# Altium schematic sheet sensor_array_interface.SchDoc
size A portrait; SheetNumber: 3; SheetTotal: 3
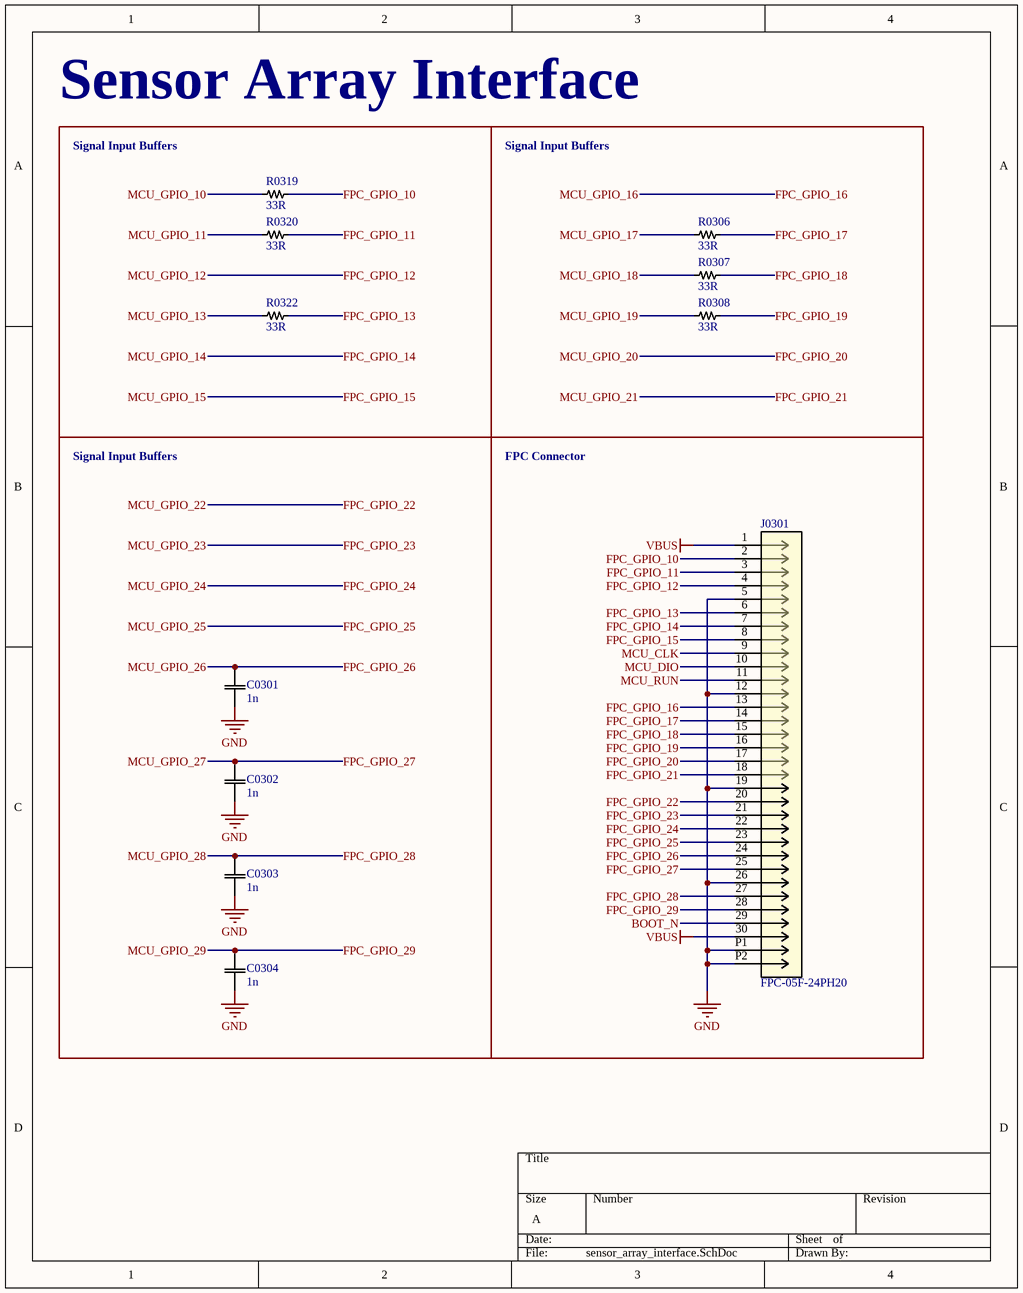
[diagram p0: sensor_array_interface.SchDoc]

## Parts
C0301  1n  [CAPC10555_55N_KEM]
C0302  1n  [CAPC10555_55N_KEM]
C0303  1n  [CAPC10555_55N_KEM]
C0304  1n  [CAPC10555_55N_KEM]
J0301  FPC-05F-24PH20  [FPC-05F-30PH20]
R0306  33R  [RES0402_CPF_TYCO_TYC]
R0307  33R  [RES0402_CPF_TYCO_TYC]
R0308  33R  [RES0402_CPF_TYCO_TYC]
R0319  33R  [RES0402_CPF_TYCO_TYC]
R0320  33R  [RES0402_CPF_TYCO_TYC]
R0322  33R  [RES0402_CPF_TYCO_TYC]

## Blocks framed on the sheet
Sensor Array Interface: R0319 R0320 R0322
Signal Input Buffers: R0306 R0307 R0308
Signal Input Buffers: C0301 C0302 C0303 C0304
FPC Connector: J0301

## Nets
GND: C0301.1 C0302.1 C0303.1 C0304.1 J0301.5 J0301.12 J0301.19 J0301.26 J0301.P1 J0301.P2
VBUS: J0301.1 J0301.30
BOOT_N: J0301.29
FPC_GPIO_10: J0301.2 R0319.1
FPC_GPIO_11: J0301.3 R0320.1
FPC_GPIO_12: J0301.4  [also labelled MCU_GPIO_12]
FPC_GPIO_13: J0301.6 R0322.1
FPC_GPIO_14: J0301.7  [also labelled MCU_GPIO_14]
FPC_GPIO_15: J0301.8  [also labelled MCU_GPIO_15]
FPC_GPIO_16: J0301.13  [also labelled MCU_GPIO_16]
FPC_GPIO_17: J0301.14 R0306.1
FPC_GPIO_18: J0301.15 R0307.1
FPC_GPIO_19: J0301.16 R0308.1
FPC_GPIO_20: J0301.17  [also labelled MCU_GPIO_20]
FPC_GPIO_21: J0301.18  [also labelled MCU_GPIO_21]
FPC_GPIO_22: J0301.20  [also labelled MCU_GPIO_22]
FPC_GPIO_23: J0301.21  [also labelled MCU_GPIO_23]
FPC_GPIO_24: J0301.22  [also labelled MCU_GPIO_24]
FPC_GPIO_25: J0301.23  [also labelled MCU_GPIO_25]
FPC_GPIO_26: C0301.2 J0301.24  [also labelled MCU_GPIO_26]
FPC_GPIO_27: C0302.2 J0301.25  [also labelled MCU_GPIO_27]
FPC_GPIO_28: C0303.2 J0301.27  [also labelled MCU_GPIO_28]
FPC_GPIO_29: C0304.2 J0301.28  [also labelled MCU_GPIO_29]
MCU_CLK: J0301.9
MCU_DIO: J0301.10
MCU_GPIO_10: R0319.2
MCU_GPIO_11: R0320.2
MCU_GPIO_13: R0322.2
MCU_GPIO_17: R0306.2
MCU_GPIO_18: R0307.2
MCU_GPIO_19: R0308.2
MCU_RUN: J0301.11

## Notes on the sheet
- Signal Input Buffers

## Library data of the parts
C0301 C0302 C0303 C0304 = C0402: SMD Comm X7R, Ceramic, SMD, MLCC, Temperature Stable, 0402; Manufacturer_Name: Kemet; Manufacturer_Part_Number: C0402C104K4RACTU; Copyright: Copyright (C) 2025 Ultra Librarian. All rights reserved.; Datasheet: https://content.kemet.com/datasheets/KEM_C1002_X7R_SMD.pdf
J0301 = FPC-05F-24PH20_1: 24 Pin 0.5 Pitch FPC connector
R0306 R0307 R0308 R0319 R0320 R0322 = R0402: CPF 0402 RL; Manufacturer_Name: TE Connectivity; Manufacturer_Part_Number: CPF0402B33RE1; Copyright: Copyright (C) 2025 Ultra Librarian. All rights reserved.; Datasheet: https://www.te.com/commerce/DocumentDelivery/DDEController?Action=srchrtrv&DocNm=1773200&DocType=Data+Sheet&DocLang=English&PartCntxt=1-1879208-3&DocFormat=pdf